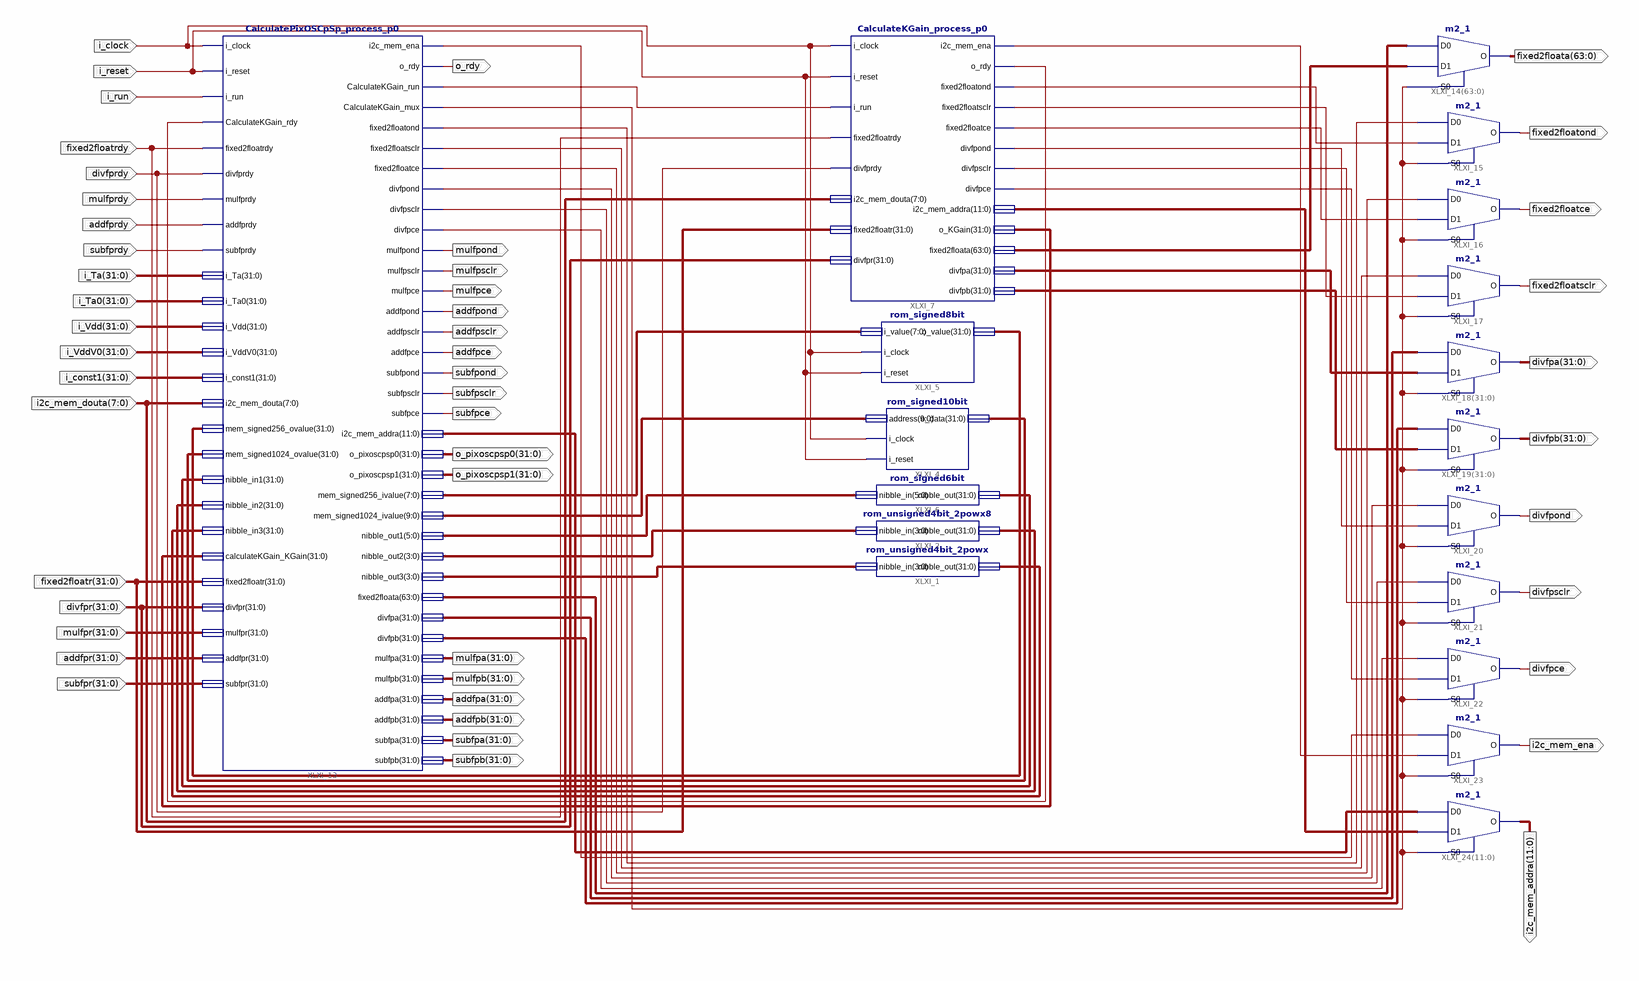
[diagram p0: schematic sheet 1]
// Xilinx ISE schematic CalculatePixOSCpSp.sch (virtex4) as structural Verilog: 18 symbols, 48 ports
module CalculatePixOSCpSp (
  input  i_clock,
  input  i_reset,
  input  fixed2floatrdy,
  input  divfprdy,
  input  [7:0] i2c_mem_douta,
  input  [31:0] fixed2floatr,
  input  [31:0] divfpr,
  input  i_run,
  input  mulfprdy,
  input  addfprdy,
  input  subfprdy,
  input  [31:0] i_Ta,
  input  [31:0] i_Ta0,
  input  [31:0] i_Vdd,
  input  [31:0] i_VddV0,
  input  [31:0] i_const1,
  input  [31:0] mulfpr,
  input  [31:0] addfpr,
  input  [31:0] subfpr,
  output [63:0] fixed2floata,
  output fixed2floatond,
  output fixed2floatce,
  output fixed2floatsclr,
  output [31:0] divfpa,
  output [31:0] divfpb,
  output divfpond,
  output divfpsclr,
  output divfpce,
  output i2c_mem_ena,
  output [11:0] i2c_mem_addra,
  output [31:0] subfpb,
  output [31:0] subfpa,
  output [31:0] addfpb,
  output [31:0] addfpa,
  output [31:0] mulfpb,
  output [31:0] mulfpa,
  output [31:0] o_pixoscpsp1,
  output [31:0] o_pixoscpsp0,
  output subfpce,
  output subfpsclr,
  output subfpond,
  output addfpce,
  output addfpsclr,
  output addfpond,
  output mulfpce,
  output mulfpsclr,
  output mulfpond,
  output o_rdy
);

  wire kgainmux, XLXN_11, XLXN_12, XLXN_19, XLXN_20, XLXN_21, XLXN_23, XLXN_24, XLXN_25, XLXN_32, XLXN_33,
       XLXN_34, XLXN_37, XLXN_38, XLXN_39, XLXN_55, XLXN_57;
  wire [3:0] XLXN_3, XLXN_5;
  wire [5:0] XLXN_1;
  wire [7:0] XLXN_7;
  wire [9:0] XLXN_8;
  wire [11:0] XLXN_56, XLXN_58;
  wire [31:0] XLXN_2, XLXN_4, XLXN_6, XLXN_9, XLXN_10, XLXN_30, XLXN_31, XLXN_35, XLXN_36, XLXN_59;
  wire [63:0] XLXN_18, XLXN_22;

  CalculateKGain_process_p0 XLXI_7 (
    .i_clock(i_clock), .i_reset(i_reset), .i_run(XLXN_12), .fixed2floatrdy(fixed2floatrdy),
    .divfprdy(divfprdy), .i2c_mem_douta(i2c_mem_douta), .fixed2floatr(fixed2floatr), .divfpr(divfpr),
    .i2c_mem_ena(XLXN_55), .o_rdy(XLXN_11), .fixed2floatond(XLXN_19), .fixed2floatsclr(XLXN_21),
    .fixed2floatce(XLXN_20), .divfpond(XLXN_32), .divfpsclr(XLXN_33), .divfpce(XLXN_34),
    .i2c_mem_addra(XLXN_56), .o_KGain(XLXN_59), .fixed2floata(XLXN_18), .divfpa(XLXN_30), .divfpb(XLXN_31));
  rom_unsigned4bit_2powx XLXI_1 (.nibble_in(XLXN_5), .nibble_out(XLXN_6));
  rom_signed10bit XLXI_4 (.address(XLXN_8), .i_clock(i_clock), .i_reset(i_reset), .o_data(XLXN_10));
  rom_signed8bit XLXI_5 (.i_value(XLXN_7), .i_clock(i_clock), .i_reset(i_reset), .o_value(XLXN_9));
  rom_unsigned4bit_2powx8 XLXI_2 (.nibble_in(XLXN_3), .nibble_out(XLXN_4));
  rom_signed6bit XLXI_6 (.nibble_in(XLXN_1), .nibble_out(XLXN_2));
  CalculatePixOSCpSp_process_p0 XLXI_13 (
    .i_clock(i_clock), .i_reset(i_reset), .i_run(i_run), .CalculateKGain_rdy(XLXN_11),
    .fixed2floatrdy(fixed2floatrdy), .divfprdy(divfprdy), .mulfprdy(mulfprdy), .addfprdy(addfprdy),
    .subfprdy(subfprdy), .i_Ta(i_Ta), .i_Ta0(i_Ta0), .i_Vdd(i_Vdd), .i_VddV0(i_VddV0), .i_const1(i_const1),
    .i2c_mem_douta(i2c_mem_douta), .mem_signed256_ovalue(XLXN_9), .mem_signed1024_ovalue(XLXN_10),
    .nibble_in1(XLXN_2), .nibble_in2(XLXN_4), .nibble_in3(XLXN_6), .calculateKGain_KGain(XLXN_59),
    .fixed2floatr(fixed2floatr), .divfpr(divfpr), .mulfpr(mulfpr), .addfpr(addfpr), .subfpr(subfpr),
    .i2c_mem_ena(XLXN_57), .o_rdy(o_rdy), .CalculateKGain_run(XLXN_12), .CalculateKGain_mux(kgainmux),
    .fixed2floatond(XLXN_23), .fixed2floatsclr(XLXN_25), .fixed2floatce(XLXN_24), .divfpond(XLXN_37),
    .divfpsclr(XLXN_38), .divfpce(XLXN_39), .mulfpond(mulfpond), .mulfpsclr(mulfpsclr), .mulfpce(mulfpce),
    .addfpond(addfpond), .addfpsclr(addfpsclr), .addfpce(addfpce), .subfpond(subfpond),
    .subfpsclr(subfpsclr), .subfpce(subfpce), .i2c_mem_addra(XLXN_58), .o_pixoscpsp0(o_pixoscpsp0),
    .o_pixoscpsp1(o_pixoscpsp1), .mem_signed256_ivalue(XLXN_7), .mem_signed1024_ivalue(XLXN_8),
    .nibble_out1(XLXN_1), .nibble_out2(XLXN_3), .nibble_out3(XLXN_5), .fixed2floata(XLXN_22),
    .divfpa(XLXN_35), .divfpb(XLXN_36), .mulfpa(mulfpa), .mulfpb(mulfpb), .addfpa(addfpa), .addfpb(addfpb),
    .subfpa(subfpa), .subfpb(subfpb));
  m2_1 XLXI_14[63:0] (.D0(XLXN_22), .D1(XLXN_18), .S0(kgainmux), .O(fixed2floata));
  m2_1 XLXI_15 (.D0(XLXN_23), .D1(XLXN_19), .S0(kgainmux), .O(fixed2floatond));
  m2_1 XLXI_16 (.D0(XLXN_24), .D1(XLXN_20), .S0(kgainmux), .O(fixed2floatce));
  m2_1 XLXI_17 (.D0(XLXN_25), .D1(XLXN_21), .S0(kgainmux), .O(fixed2floatsclr));
  m2_1 XLXI_18[31:0] (.D0(XLXN_35), .D1(XLXN_30), .S0(kgainmux), .O(divfpa));
  m2_1 XLXI_19[31:0] (.D0(XLXN_36), .D1(XLXN_31), .S0(kgainmux), .O(divfpb));
  m2_1 XLXI_20 (.D0(XLXN_37), .D1(XLXN_32), .S0(kgainmux), .O(divfpond));
  m2_1 XLXI_21 (.D0(XLXN_38), .D1(XLXN_33), .S0(kgainmux), .O(divfpsclr));
  m2_1 XLXI_22 (.D0(XLXN_39), .D1(XLXN_34), .S0(kgainmux), .O(divfpce));
  m2_1 XLXI_23 (.D0(XLXN_57), .D1(XLXN_55), .S0(kgainmux), .O(i2c_mem_ena));
  m2_1 XLXI_24[11:0] (.D0(XLXN_58), .D1(XLXN_56), .S0(kgainmux), .O(i2c_mem_addra));
endmodule
